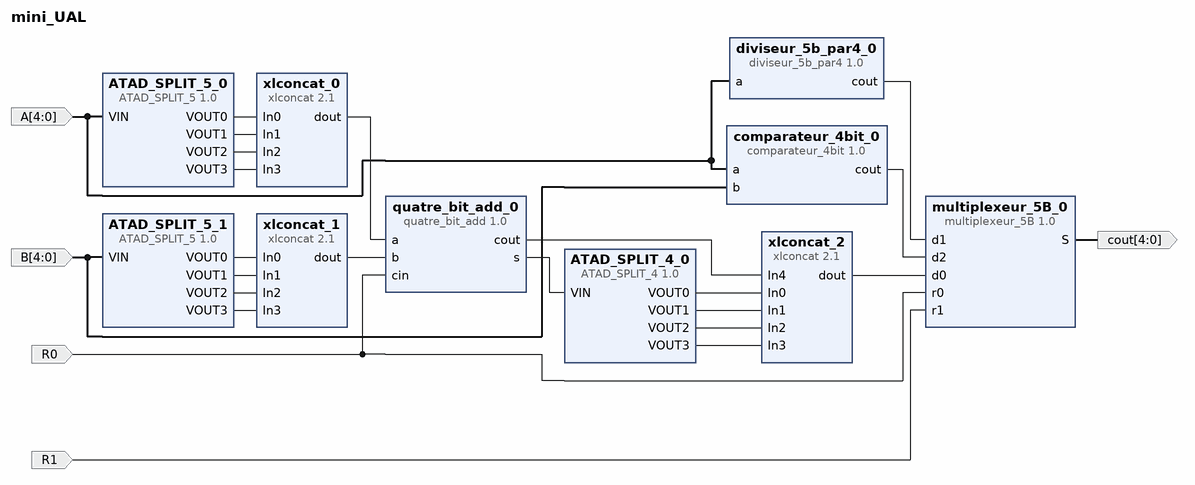
[diagram p0: block diagram of the top level]
# Vivado block design mini_UAL, xc7a100tcsg324-1, Vivado 2018.3
create_bd_design mini_UAL

create_bd_port -dir I -from 4 -to 0 A
create_bd_port -dir I -from 4 -to 0 B
create_bd_port -dir I R0
create_bd_port -dir I R1
create_bd_port -dir O -from 4 -to 0 cout

create_bd_cell -type ip -vlnv polymtl.ca:user:quatre_bit_add:1.0 quatre_bit_add_0
create_bd_cell -type ip -vlnv polymtl.ca:user:diviseur_5b_par4:1.0 diviseur_5b_par4_0
create_bd_cell -type ip -vlnv polymtl.ca:user:comparateur_4bit:1.0 comparateur_4bit_0
create_bd_cell -type ip -vlnv xilinx.com:user:ATAD_SPLIT_5:1.0 ATAD_SPLIT_5_0
create_bd_cell -type ip -vlnv xilinx.com:user:ATAD_SPLIT_5:1.0 ATAD_SPLIT_5_1
create_bd_cell -type ip -vlnv xilinx.com:ip:xlconcat:2.1 xlconcat_0
set_property -dict {CONFIG.NUM_PORTS 4} [get_bd_cells xlconcat_0]
create_bd_cell -type ip -vlnv xilinx.com:ip:xlconcat:2.1 xlconcat_1
set_property -dict {CONFIG.NUM_PORTS 4} [get_bd_cells xlconcat_1]
create_bd_cell -type ip -vlnv xilinx.com:user:ATAD_SPLIT_4:1.0 ATAD_SPLIT_4_0
create_bd_cell -type ip -vlnv xilinx.com:ip:xlconcat:2.1 xlconcat_2
set_property -dict {CONFIG.NUM_PORTS 5} [get_bd_cells xlconcat_2]
create_bd_cell -type ip -vlnv polymtl.ca:user:multiplexeur_5B:1.0 multiplexeur_5B_0

# ---- connections ----

connect_bd_net [get_bd_ports A] [get_bd_pins diviseur_5b_par4_0/a] [get_bd_pins comparateur_4bit_0/a] [get_bd_pins ATAD_SPLIT_5_0/VIN]
connect_bd_net [get_bd_ports B] [get_bd_pins comparateur_4bit_0/b] [get_bd_pins ATAD_SPLIT_5_1/VIN]
connect_bd_net [get_bd_pins ATAD_SPLIT_5_0/VOUT0] [get_bd_pins xlconcat_0/In0]
connect_bd_net [get_bd_pins ATAD_SPLIT_5_0/VOUT1] [get_bd_pins xlconcat_0/In1]
connect_bd_net [get_bd_pins ATAD_SPLIT_5_0/VOUT2] [get_bd_pins xlconcat_0/In2]
connect_bd_net [get_bd_pins ATAD_SPLIT_5_0/VOUT3] [get_bd_pins xlconcat_0/In3]
connect_bd_net [get_bd_pins ATAD_SPLIT_5_1/VOUT0] [get_bd_pins xlconcat_1/In0]
connect_bd_net [get_bd_pins ATAD_SPLIT_5_1/VOUT1] [get_bd_pins xlconcat_1/In1]
connect_bd_net [get_bd_pins ATAD_SPLIT_5_1/VOUT2] [get_bd_pins xlconcat_1/In2]
connect_bd_net [get_bd_pins ATAD_SPLIT_5_1/VOUT3] [get_bd_pins xlconcat_1/In3]
connect_bd_net [get_bd_pins xlconcat_0/dout] [get_bd_pins quatre_bit_add_0/a]
connect_bd_net [get_bd_pins xlconcat_1/dout] [get_bd_pins quatre_bit_add_0/b]
connect_bd_net [get_bd_pins quatre_bit_add_0/s] [get_bd_pins ATAD_SPLIT_4_0/VIN]
connect_bd_net [get_bd_pins quatre_bit_add_0/cout] [get_bd_pins xlconcat_2/In4]
connect_bd_net [get_bd_pins ATAD_SPLIT_4_0/VOUT0] [get_bd_pins xlconcat_2/In0]
connect_bd_net [get_bd_pins ATAD_SPLIT_4_0/VOUT1] [get_bd_pins xlconcat_2/In1]
connect_bd_net [get_bd_pins ATAD_SPLIT_4_0/VOUT2] [get_bd_pins xlconcat_2/In2]
connect_bd_net [get_bd_pins ATAD_SPLIT_4_0/VOUT3] [get_bd_pins xlconcat_2/In3]
connect_bd_net -net R0_1 [get_bd_ports R0] [get_bd_pins quatre_bit_add_0/cin] [get_bd_pins multiplexeur_5B_0/r0]
connect_bd_net [get_bd_pins xlconcat_2/dout] [get_bd_pins multiplexeur_5B_0/d0]
connect_bd_net [get_bd_pins diviseur_5b_par4_0/cout] [get_bd_pins multiplexeur_5B_0/d1]
connect_bd_net [get_bd_pins comparateur_4bit_0/cout] [get_bd_pins multiplexeur_5B_0/d2]
connect_bd_net -net R1_1 [get_bd_ports R1] [get_bd_pins multiplexeur_5B_0/r1]
connect_bd_net [get_bd_pins multiplexeur_5B_0/S] [get_bd_ports cout]

validate_bd_design
save_bd_design
